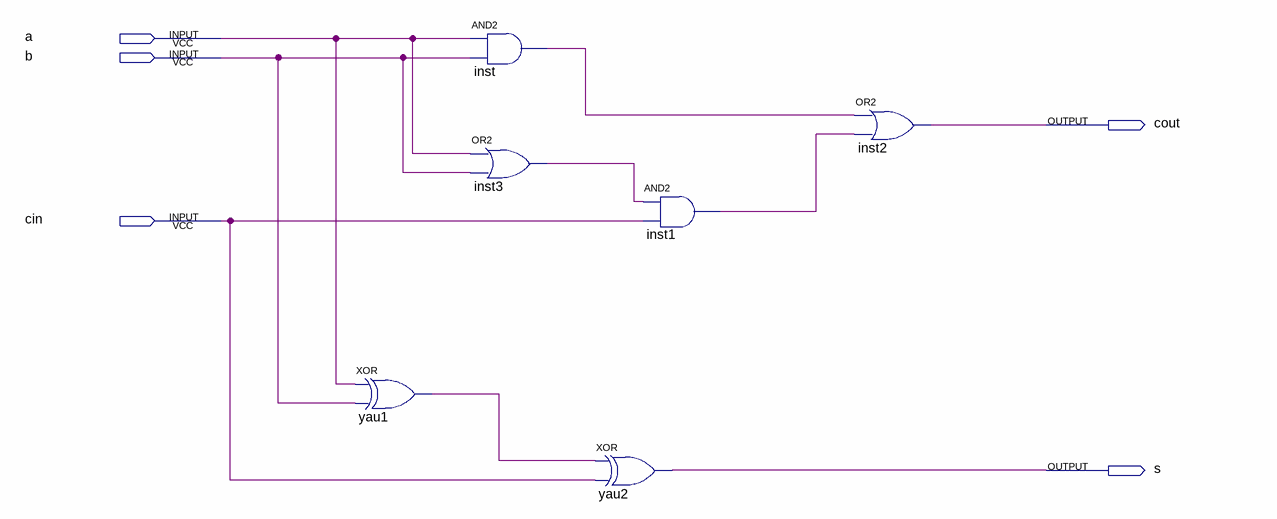
[diagram p0: schematic sheet]
// Quartus schematic FullAdder.bdf as structural Verilog: 6 symbols, 5 pins
module FullAdder (
  input  a,
  input  b,
  input  cin,
  output cout,
  output s
);

  wire inst1_out, inst3_out, inst_out, yau1_out;

  xor yau1 (yau1_out, a, b);
  and inst (inst_out, a, b);
  or inst3 (inst3_out, a, b);
  xor yau2 (s, yau1_out, cin);
  and inst1 (inst1_out, inst3_out, cin);
  or inst2 (cout, inst_out, inst1_out);
endmodule
